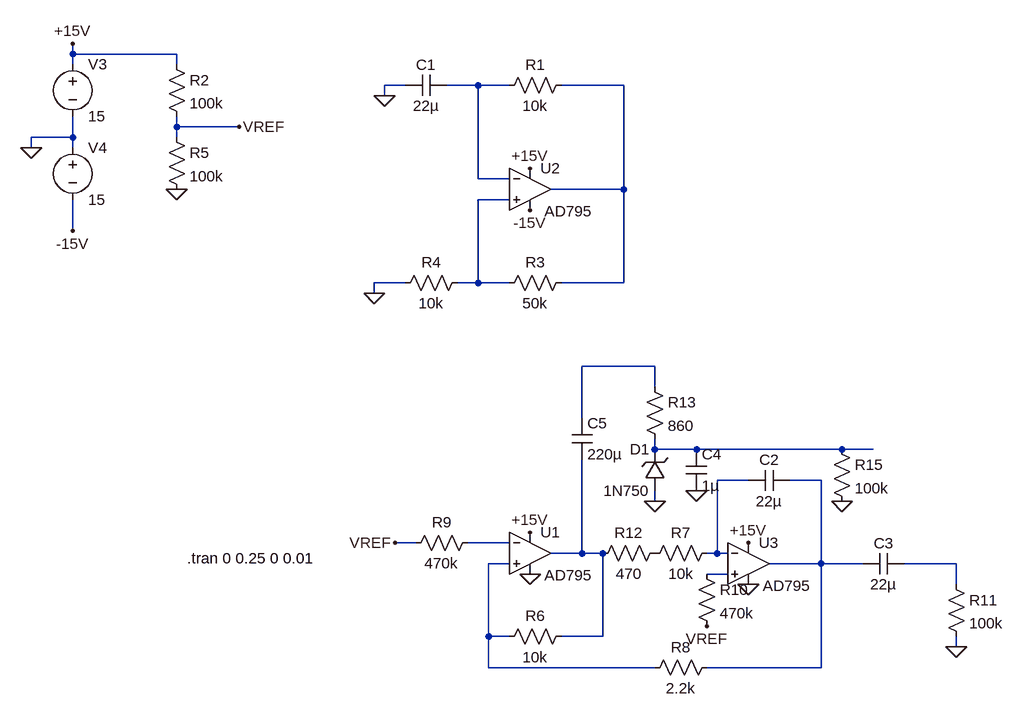
[diagram p0: schematic LFO.asc]
LFO.asc, the LTspice schematic file:
Version 4
SHEET 1 1688 1336
WIRE -496 0 -496 -16
WIRE -336 0 -496 0
WIRE -496 16 -496 0
WIRE -336 16 -336 0
WIRE 16 48 -16 48
WIRE 128 48 80 48
WIRE 176 48 128 48
WIRE 352 48 256 48
WIRE -16 64 -16 48
WIRE -336 112 -336 96
WIRE -240 112 -336 112
WIRE -496 128 -496 96
WIRE -496 128 -560 128
WIRE -336 128 -336 112
WIRE -560 144 -560 128
WIRE -496 144 -496 128
WIRE 128 192 128 48
WIRE 176 192 128 192
WIRE 352 208 352 48
WIRE 352 208 240 208
WIRE 176 224 128 224
WIRE -496 272 -496 224
WIRE 16 352 -32 352
WIRE 128 352 128 224
WIRE 128 352 96 352
WIRE 176 352 128 352
WIRE 352 352 352 208
WIRE 352 352 256 352
WIRE -32 368 -32 352
WIRE 400 480 288 480
WIRE 400 512 400 480
WIRE 288 560 288 480
WIRE 400 608 400 592
WIRE 464 608 400 608
WIRE 688 608 464 608
WIRE 736 608 688 608
WIRE 544 656 496 656
WIRE 656 656 608 656
WIRE 400 688 400 672
WIRE 32 752 0 752
WIRE 176 752 112 752
WIRE 288 768 288 624
WIRE 288 768 240 768
WIRE 320 768 288 768
WIRE 496 768 496 656
WIRE 496 768 480 768
WIRE 512 768 496 768
WIRE 176 784 144 784
WIRE 656 784 656 656
WIRE 656 784 576 784
WIRE 720 784 656 784
WIRE 864 784 784 784
WIRE 512 800 480 800
WIRE 864 816 864 784
WIRE 144 896 144 784
WIRE 176 896 144 896
WIRE 320 896 320 768
WIRE 320 896 256 896
WIRE 864 912 864 896
WIRE 144 944 144 896
WIRE 400 944 144 944
WIRE 656 944 656 784
WIRE 656 944 480 944
FLAG -560 144 0
FLAG -496 -16 +15V
FLAG -496 272 -15V
FLAG 208 176 +15V
FLAG -336 208 0
FLAG -240 112 VREF
FLAG 208 240 -15V
FLAG -32 368 0
FLAG -16 64 0
FLAG 208 736 +15V
FLAG 544 752 +15V
FLAG 0 752 VREF
FLAG 208 800 0
FLAG 544 816 0
FLAG 480 880 VREF
FLAG 864 912 0
FLAG 400 688 0
FLAG 464 672 0
FLAG 688 688 0
SYMBOL voltage -496 0 R0
WINDOW 123 0 0 Left 0
WINDOW 39 0 0 Left 0
SYMATTR InstName V3
SYMATTR Value 15
SYMBOL voltage -496 128 R0
WINDOW 123 0 0 Left 0
WINDOW 39 0 0 Left 0
SYMATTR InstName V4
SYMATTR Value 15
SYMBOL Opamps\\AD795 208 144 R0
WINDOW 3 22 98 Left 2
SYMATTR InstName U2
SYMBOL res -352 0 R0
SYMATTR InstName R2
SYMATTR Value 100k
SYMBOL res -352 112 R0
SYMATTR InstName R5
SYMATTR Value 100k
SYMBOL res 272 32 R90
WINDOW 0 0 56 VBottom 2
WINDOW 3 32 56 VTop 2
SYMATTR InstName R1
SYMATTR Value 10k
SYMBOL res 272 336 R90
WINDOW 0 0 56 VBottom 2
WINDOW 3 32 56 VTop 2
SYMATTR InstName R3
SYMATTR Value 50k
SYMBOL res 112 336 R90
WINDOW 0 0 56 VBottom 2
WINDOW 3 32 56 VTop 2
SYMATTR InstName R4
SYMATTR Value 10k
SYMBOL cap 80 32 R90
WINDOW 0 0 32 VBottom 2
WINDOW 3 32 32 VTop 2
SYMATTR InstName C1
SYMATTR Value 22µ
SYMBOL Opamps\\AD795 208 704 R0
WINDOW 3 22 98 Left 2
SYMATTR InstName U1
SYMBOL res 272 880 R90
WINDOW 0 0 56 VBottom 2
WINDOW 3 32 56 VTop 2
SYMATTR InstName R6
SYMATTR Value 10k
SYMBOL res 496 752 R90
WINDOW 0 0 56 VBottom 2
WINDOW 3 32 56 VTop 2
SYMATTR InstName R7
SYMATTR Value 10k
SYMBOL Opamps\\AD795 544 720 R0
WINDOW 3 22 98 Left 2
SYMATTR InstName U3
SYMBOL cap 608 640 R90
WINDOW 0 0 32 VBottom 2
WINDOW 3 32 32 VTop 2
SYMATTR InstName C2
SYMATTR Value 22µ
SYMBOL res 496 928 R90
WINDOW 0 0 56 VBottom 2
WINDOW 3 32 56 VTop 2
SYMATTR InstName R8
SYMATTR Value 2.2k
SYMBOL res 128 736 R90
WINDOW 0 0 56 VBottom 2
WINDOW 3 32 56 VTop 2
SYMATTR InstName R9
SYMATTR Value 470k
SYMBOL res 464 784 R0
SYMATTR InstName R10
SYMATTR Value 470k
SYMBOL cap 784 768 R90
WINDOW 0 0 32 VBottom 2
WINDOW 3 32 32 VTop 2
SYMATTR InstName C3
SYMATTR Value 22µ
SYMBOL res 848 800 R0
SYMATTR InstName R11
SYMATTR Value 100k
SYMBOL res 416 752 R90
WINDOW 0 0 56 VBottom 2
WINDOW 3 32 56 VTop 2
SYMATTR InstName R12
SYMATTR Value 470
SYMBOL zener 416 672 R180
WINDOW 0 24 64 Left 2
WINDOW 3 24 0 Left 2
SYMATTR InstName D1
SYMATTR Value 1N750
SYMBOL res 384 496 R0
SYMATTR InstName R13
SYMATTR Value 860
SYMBOL cap 448 608 R0
SYMATTR InstName C4
SYMATTR Value 1µ
SYMBOL res 672 592 R0
SYMATTR InstName R15
SYMATTR Value 100k
SYMBOL cap 272 560 R0
SYMATTR InstName C5
SYMATTR Value 220µ
TEXT -320 776 Left 2 !.tran 0 0.25 0 0.01

The netlist it stands for:
* LFO.asc
V3 +15V 0 15
V4 0 -15V 15
XU2 N003 N001 +15V -15V N002 AD795  ; pins In+ In- V+ V- OUT
R2 +15V VREF 100k
R5 VREF 0 100k
R1 N002 N001 10k
R3 N002 N003 50k
R4 N003 0 10k
C1 N001 0 22µ
XU1 N010 N008 +15V 0 N009 AD795  ; pins In+ In- V+ V- OUT
R6 N009 N010 10k
R7 N006 P001 10k
XU3 N012 N006 +15V 0 N007 AD795  ; pins In+ In- V+ V- OUT
C2 N007 N006 22µ
R8 N007 N010 2.2k
R9 N008 VREF 470k
R10 N012 VREF 470k
C3 N011 N007 22µ
R11 N011 0 100k
R12 P001 N009 470
D1 0 N005 1N750
R13 N004 N005 860
C4 N005 0 1µ
R15 N005 0 100k
C5 N004 N009 220µ
.model D D
.lib standard.dio
.tran 0 0.25 0 0.01
.lib ADI1.lib
.backanno
.end